# EAGLE design schematic (EAGLE 7.1.0)
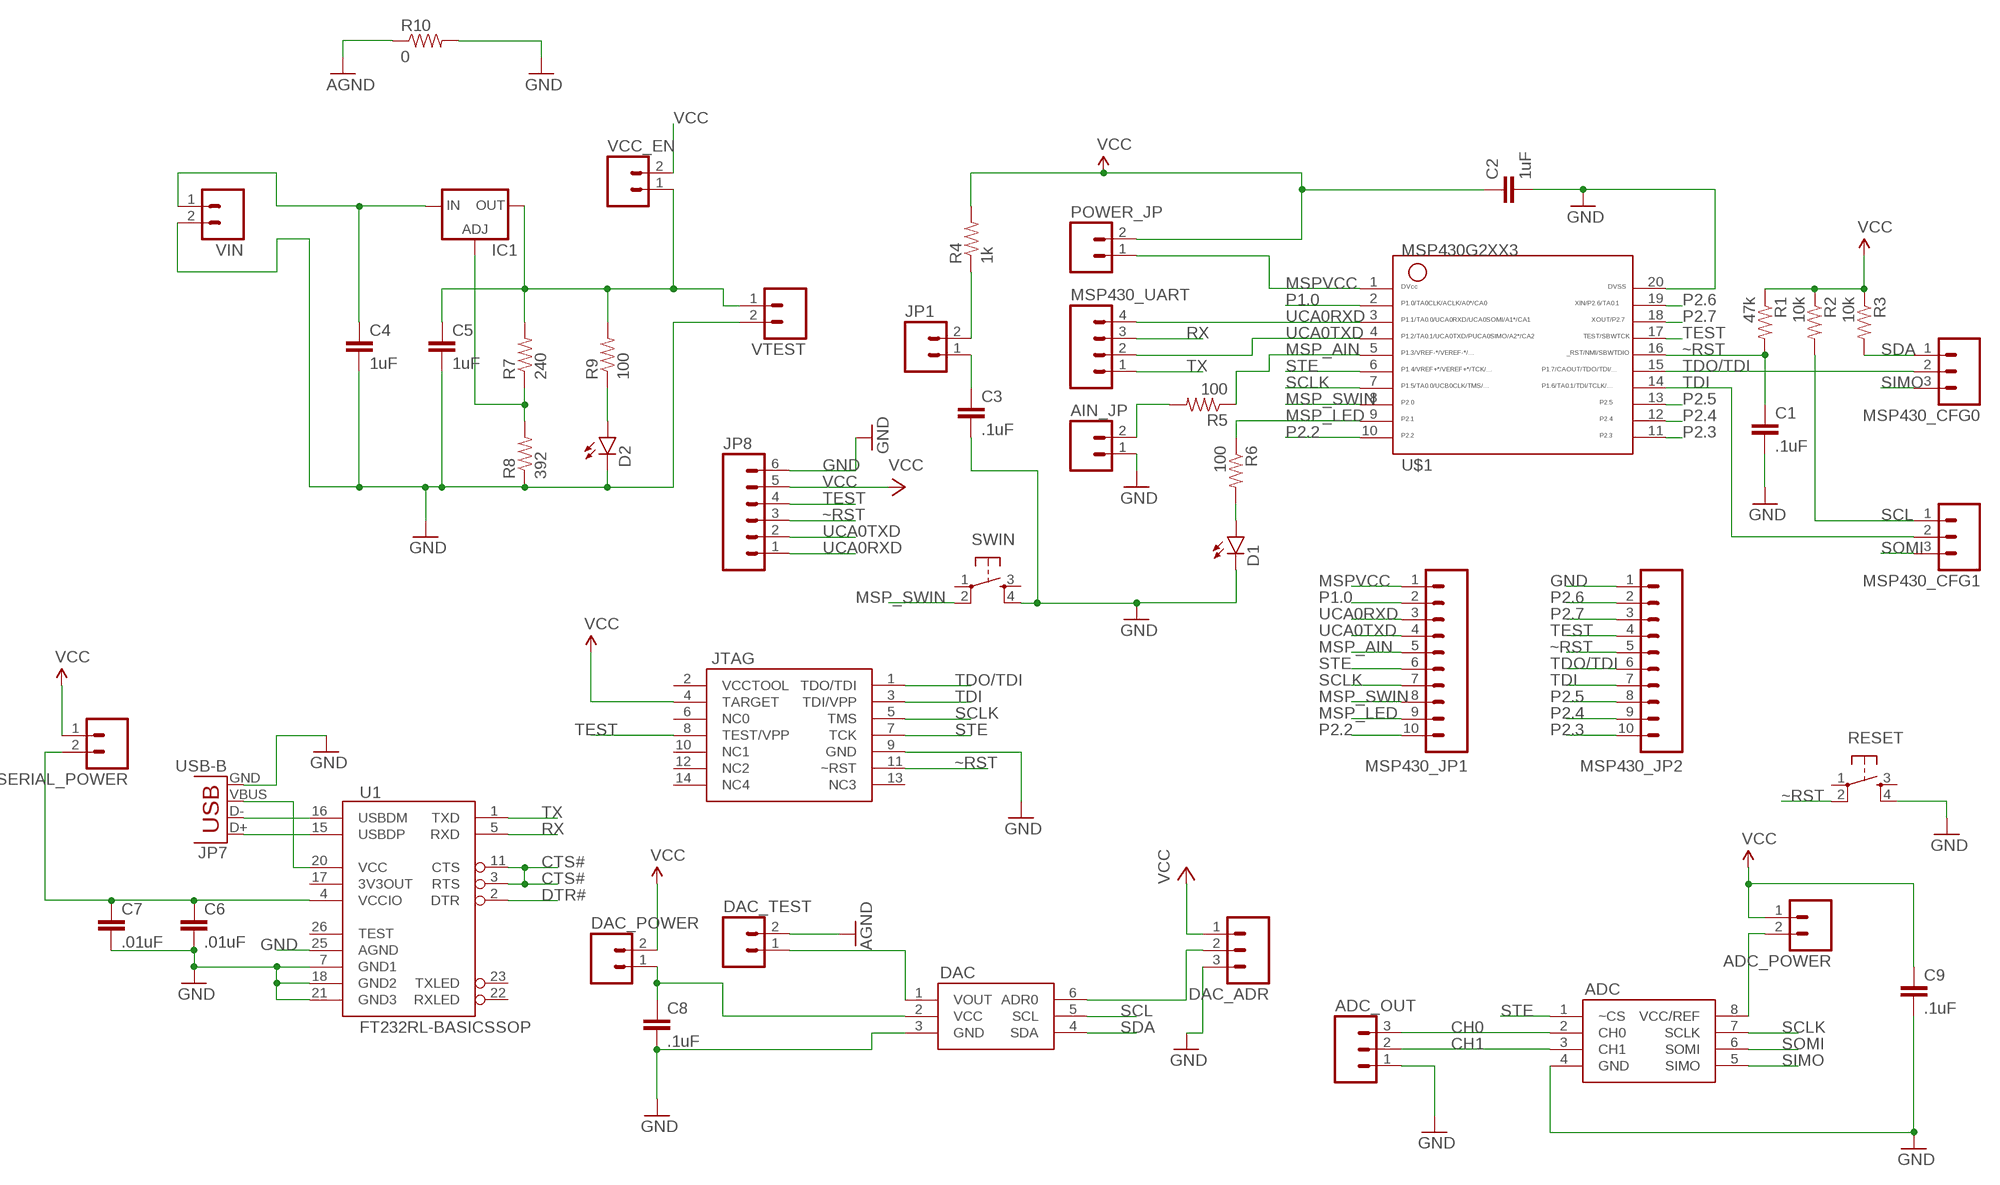
[diagram p0: schematic, sheet 1]

## Parts
ADC  TLC0832CPE4  [DIP08]
ADC_OUT  M03LOCK  [1X03_LOCK]
ADC_POWER  M02LOCK  [1X02_LOCK]
AIN_JP  M02LOCK  [1X02_LOCK]
C1  .1uF  0.1UF-50V-20%(PTH)KIT-EZ  [CAP-PTH-SMALL-KIT]
C2  1uF  CAPKIT  [CAP-PTH-SMALL-KIT]
C3  .1uF  CAPEZ  [CAP-PTH-SMALLEZ]
C4  1uF  CAPEZ  [CAP-PTH-SMALLEZ]
C5  1uF  CAPEZ  [CAP-PTH-SMALLEZ]
C6  .01uF  CAPEZ  [CAP-PTH-SMALLEZ]
C7  .01uF  CAPEZ  [CAP-PTH-SMALLEZ]
C8  .1uF  CAPEZ  [CAP-PTH-SMALLEZ]
C9  .1uF  CAPEZ  [CAP-PTH-SMALLEZ]
D1  LED5MM  [LED5MM]
D2  LED5MM  [LED5MM]
DAC  DAC121C081CIMK  [SOT23-6]
DAC_ADR  M03LOCK  [1X03_LOCK]
DAC_POWER  M02LOCK  [1X02_LOCK]
DAC_TEST  M02LOCK  [1X02_LOCK]
IC1  LM317TS  [317TS]
JP1  M02LOCK  [1X02_LOCK]
JP7  USB-B  USBPTH  [USB-B-PTH]
JP8  M06LOCK  [1X06_LOCK]
JTAG  JTAG  [2X7]
MSP430_CFG0  M03LOCK_NO_SILK  [1X03_LOCK_NO_SILK]
MSP430_CFG1  M03LOCK_NO_SILK  [1X03_LOCK_NO_SILK]
MSP430_JP1  M10LOCK  [1X10_LOCK]
MSP430_JP2  M10LOCK  [1X10_LOCK]
MSP430_UART  M04LOCK_LONGPADS  [1X04_LOCK_LONGPADS]
POWER_JP  M02LOCK  [1X02_LOCK]
R1  47k  RESISTOREZ  [AXIAL-0.3EZ]
R2  10k  RESISTOREZ  [AXIAL-0.3EZ]
R3  10k  RESISTOREZ  [AXIAL-0.3EZ]
R4  1k  RESISTOREZ  [AXIAL-0.3EZ]
R5  100  RESISTOREZ  [AXIAL-0.3EZ]
R6  100  RESISTOREZ  [AXIAL-0.3EZ]
R7  240  RESISTOREZ  [AXIAL-0.3EZ]
R8  392  RESISTOREZ  [AXIAL-0.3EZ]
R9  100  RESISTOREZ  [AXIAL-0.3EZ]
R10  0  RESISTOREZ  [AXIAL-0.3EZ]
RESET  TAC_SWITCHPTH  [TACTILE-PTH]
SERIAL_POWER  M02LOCK  [1X02_LOCK]
SWIN  TAC_SWITCHPTH  [TACTILE-PTH]
U1  FT232RL-BASICSSOP  [SSOP28DB]
U$1  G2XX3---N20  [N20]
VCC_EN  M02LOCK  [1X02_LOCK]
VIN  M02LOCK  [1X02_LOCK]
VTEST  M02LOCK  [1X02_LOCK]

## Nets
CH0: ADC.2(CH0) ADC_OUT.3
CH1: ADC.3(CH1) ADC_OUT.2
CTS#: U1.3(RTS) U1.11(CTS)
DTR#: U1.2(DTR)
GND: ADC.4(GND) ADC_OUT.1 AIN_JP.1 C1.2 C2.2 C3.2 C4.2 C5.2 C6.2 C7.2 C8.2 C9.2 D1.K(C) D2.K(C) DAC.3(GND) DAC_ADR.3 DAC_TEST.2 JP7.GND JP8.6 JTAG.9(GND) MSP430_JP2.1 R8.P$1 R10.P$1 R10.P$2 RESET.4 SWIN.4 U1.7(GND1) U1.18(GND2) U1.21(GND3) U1.25(AGND) U$1.20 VIN.2 VTEST.2 ; supply symbol labelled AGND
MSP_AIN: MSP430_JP1.5 R5.P$1 U$1.5
MSP_LED: MSP430_JP1.9 R6.P$1 U$1.9
MSP_SWIN: MSP430_JP1.8 SWIN.2 U$1.8
MSPVCC: MSP430_JP1.1 POWER_JP.1 U$1.1
N$1: AIN_JP.2 R5.P$2
N$2: D1.A R6.P$2
N$3: JP1.2 R4.P$1
N$4: C3.1 JP1.1
N$5: C6.1 C7.1 SERIAL_POWER.2 U1.4(VCCIO)
N$6: D2.A R9.P$1
N$7: JP7.D+ U1.15(USBDP)
N$8: IC1.1(ADJ) R7.P$1 R8.P$2
N$9: C5.1 IC1.2(OUT) R7.P$2 R9.P$2 VCC_EN.1 VTEST.1
N$10: JP7.D- U1.16(USBDM)
N$11: C4.1 IC1.3(IN) VIN.1
N$12: JP7.VBUS U1.20(VCC)
N$13: DAC.1(VOUT) DAC_TEST.1
N$14: C8.1 DAC.2(VCC) DAC_POWER.1
N$15: ADC.8(VCC/REF) ADC_POWER.2
N$19: DAC.6(ADR0) DAC_ADR.2
P1.0: MSP430_JP1.2 U$1.2
P2.2: MSP430_JP1.10 U$1.10
P2.3: MSP430_JP2.10 U$1.11
P2.4: MSP430_JP2.9 U$1.12
P2.5: MSP430_JP2.8 U$1.13
P2.6: MSP430_JP2.2 U$1.19
P2.7: MSP430_JP2.3 U$1.18
RX: MSP430_UART.3 U1.5(RXD)
SCL: DAC.5(SCL) MSP430_CFG1.1 R2.P$2
SCLK: ADC.7(SCLK) JTAG.5(TMS) MSP430_JP1.7 U$1.7
SDA: DAC.4(SDA) MSP430_CFG0.1 R3.P$2
SIMO: ADC.5(SIMO) MSP430_CFG0.3
SOMI: ADC.6(SOMI) MSP430_CFG1.3
STE: ADC.1(~CS) JTAG.7(TCK) MSP430_JP1.6 U$1.6
TDI: JTAG.3(TDI/VPP) MSP430_CFG1.2 MSP430_JP2.7 U$1.14
TDO/TDI: JTAG.1(TDO/TDI) MSP430_CFG0.2 MSP430_JP2.6 U$1.15
TEST: JP8.4 JTAG.8(TEST/VPP) MSP430_JP2.4 U$1.17
TX: MSP430_UART.1 U1.1(TXD)
UCA0RXD: JP8.1 MSP430_JP1.3 MSP430_UART.4 U$1.3
UCA0TXD: JP8.2 MSP430_JP1.4 MSP430_UART.2 U$1.4
VCC: ADC_POWER.1 C2.1 C9.1 DAC_ADR.1 DAC_POWER.2 JP8.5 JTAG.4(TARGET) POWER_JP.2 R1.P$1 R2.P$1 R3.P$1 R4.P$2 SERIAL_POWER.1 VCC_EN.2
~RST: C1.1 JP8.3 JTAG.11(~RST) MSP430_JP2.5 R1.P$2 RESET.2 U$1.16
Unconnected: JTAG.2(VCCTOOL) JTAG.6(NC0) JTAG.10(NC1) JTAG.12(NC2) JTAG.13(NC3) JTAG.14(NC4) RESET.1 RESET.3 SWIN.1 SWIN.3 U1.17(3V3OUT) U1.22(RXLED) U1.23(TXLED) U1.26(TEST)

## Library data of the parts
ADC = senior-design:TLC0832CPE4
ADC_OUT DAC_ADR MSP430_CFG0 MSP430_CFG1 = SparkFun-Connectors:M03: Header 3 Standard 3-pin 0.1" header. Use with straight break away headers (SKU : PRT-00116), right angle break away headers (PRT-00553), swiss pins (PRT-00743), machine pins (PRT-00117), and female headers (PRT-00115). Molex polarized connector foot print use with SKU : PRT-08232 with associated crimp pins and housings.
ADC_POWER AIN_JP DAC_POWER DAC_TEST JP1 POWER_JP SERIAL_POWER VCC_EN VIN VTEST = SparkFun-Connectors:M02: Standard 2-pin 0.1" header. Use with - straight break away headers ( PRT-00116) - right angle break away headers (PRT-00553) - swiss pins (PRT-00743) - machine pins (PRT-00117) - female headers (PRT-00115) Molex polarized connector foot print use with: PRT-08233 with associated crimp pins and housings. 2.54_SCREWTERM for use with PRT-10571. 3.5mm Screw Terminal footprints for PRT-08084 5mm Screw Terminal footprints for use with PRT-08432
C1 = SparkFun-Capacitors:0.1UF-50V-20%(PTH): CAP-08370; PROD_ID: CAP-08370
C2-C9 = SparkFun-Capacitors:CAP: Capacitor Standard 0603 ceramic capacitor, and 0.1" leaded capacitor.
D1 D2 = SparkFun-LED:LED: LEDs Standard schematic elements and footprints for 5mm, 3mm, 1206, and 0603 sized LEDs. 5mm - Spark Fun Electronics SKU : COM-00529 (and others)
DAC = senior-design:DAC121C081CIMK
IC1 = v-reg:LM317TS: VOLTAGE REGULATOR
JP7 = SparkFun-Connectors:USB: USB Connectors USB-B-PTH is fully proven SKU : PRT-00139/CONN-08278 USB-miniB is fully proven SKU : PRT-00587 USB-A-PCB is untested. USB-A-H is throughly reviewed, but untested. Spark Fun Electronics SKU : PRT-00437 USB-B-SMT is throughly reviewed, but untested. Needs silkscreen touching up. USB-A-S has not been used/tested USB-MB-H has not been used/tested USB-MICROB has been used. CONN-09505; PROD_ID: CONN-08278
JP8 = SparkFun-Connectors:M06: Header 6 Standard 6-pin 0.1" header. Use with straight break away headers (SKU : PRT-00116), right angle break away headers (PRT-00553), swiss pins (PRT-00743), machine pins (PRT-00117), and female headers (PRT-00115). Molex polarized connector foot print use with SKU : PRT-08094 with associated crimp pins and housings. NOTES ON THE VARIANTS LOCK and LOCK_LONGPADS... This footprint was designed to help hold the alignment of a through-hole component (i.e. 6-pin header) while soldering it into place. You may notice that each hole has been shifted either up or down by 0.005 of an inch from it's more standard position (which is a perfectly straight line). This slight alteration caused the pins (the squares in the middle) to touch the edges of the holes. Because they are alternating, it causes a "brace" to hold the component in place. 0.005 has proven to be the perfect amount of "off-center" position when using our standard breakaway headers. Although looks a little odd when you look at the bare footprint, once you have a header in there, the alteration is very hard to notice. Also,if you push a header all the way into place, it is covered up entirely on the bottom side. This idea of altering the position of holes to aid alignment will be further integrated into the Sparkfun Library for other footprints. It can help hold any component with 3 or more connection pins.
JTAG = senior-design:JTAG
MSP430_JP1 MSP430_JP2 = SparkFun-Connectors:M10: Header 10 Standard 10-pin 0.1" header. Use with straight break away headers (SKU : PRT-00116), right angle break away headers (PRT-00553), swiss pins (PRT-00743), machine pins (PRT-00117), and female headers (PRT-00115).
MSP430_UART = SparkFun-Connectors:M04: Header 4 Standard 4-pin 0.1" header. Use with straight break away headers (SKU : PRT-00116), right angle break away headers (PRT-00553), swiss pins (PRT-00743), machine pins (PRT-00117), and female headers (PRT-00115). Molex polarized connector foot print use with SKU : PRT-08231 with associated crimp pins and housings. 1MM SMD Version SKU: PRT-10208
R1-R10 = SparkFun-Passives:RESISTOR: Resistor Basic schematic elements and footprints for 0603, 1206, and PTH resistors.
RESET SWIN = SparkFun-Retired:TAC_SWITCH: Momentary Switch Button commonly used for reset or general input. Spark Fun Electronics SKU : COM-00097 SMT- SWCH-08247
U1 = SparkFun-DigitalIC:FT232RL-BASIC: USB UART This is the simplified version of the FT232RL unit. Only what you need, nothing you don't. Spark Fun Electronics SKU : COM-00650
U$1 = TI_MSP430_v16:G2XX3---N20: MSP430G2XX1 PDIP (N) 20 Pin Package

## Board
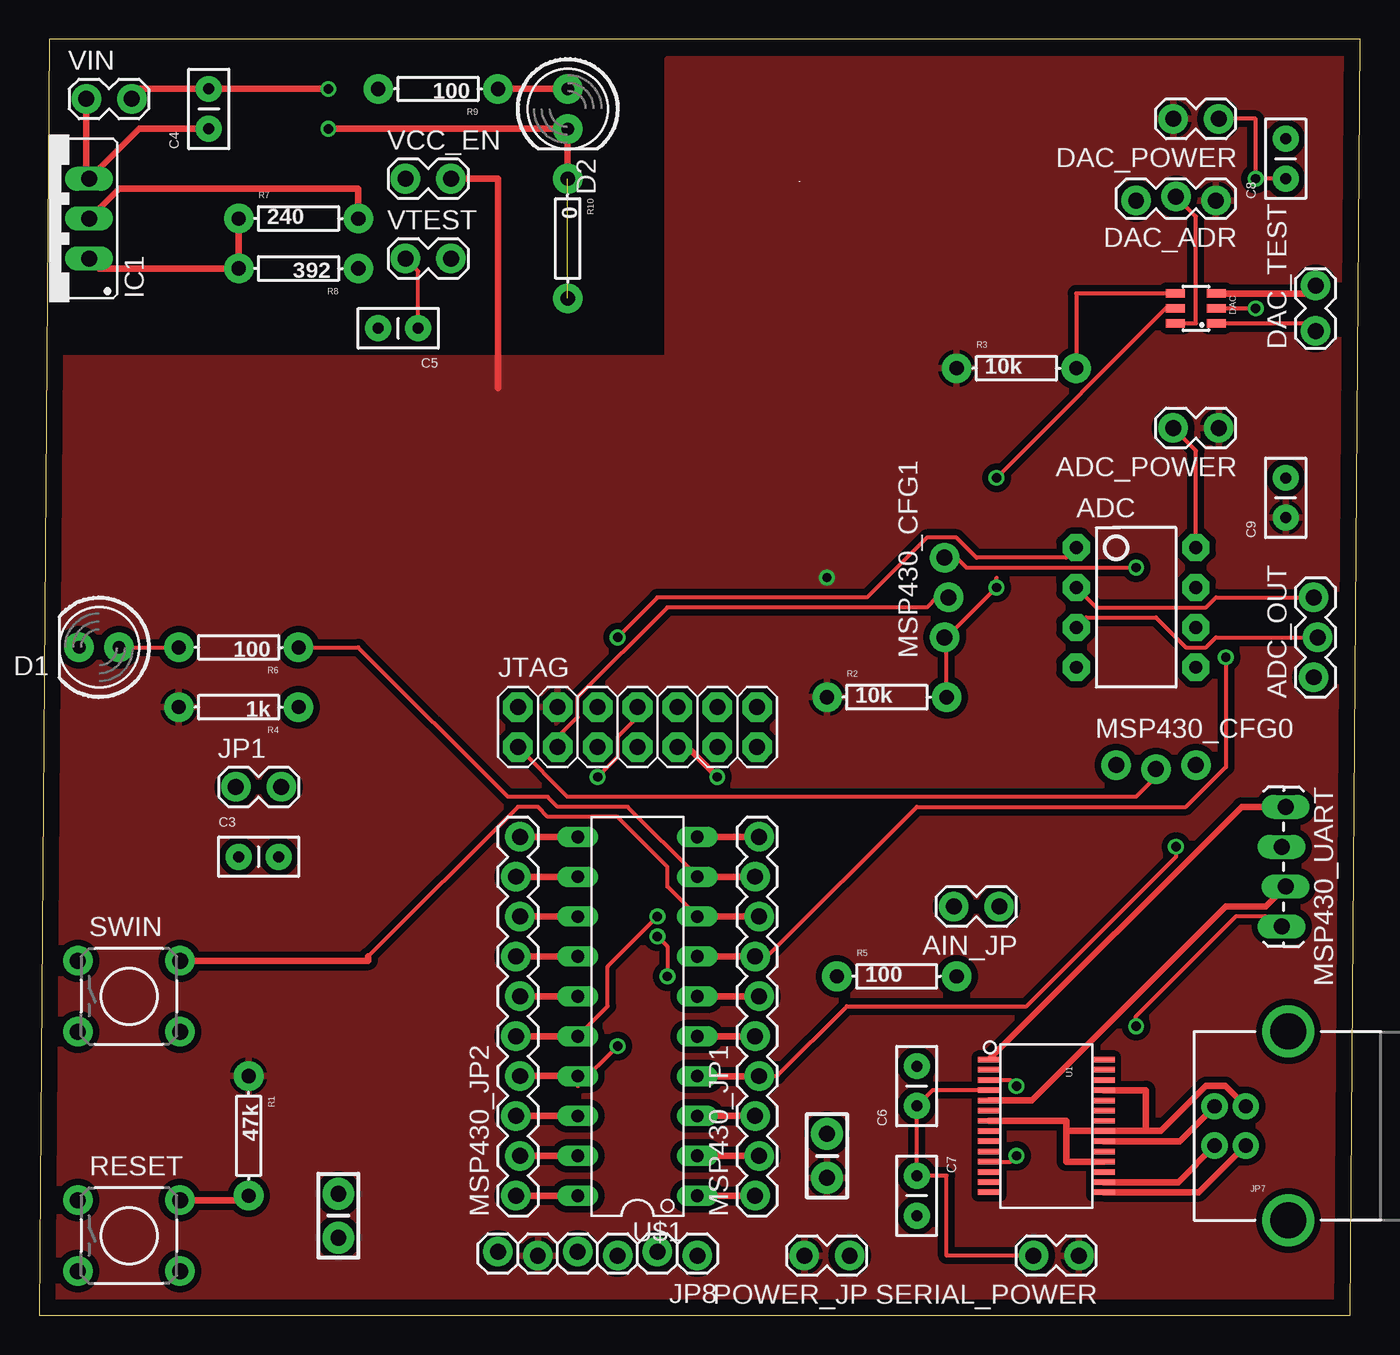
[diagram p1: board, top side]
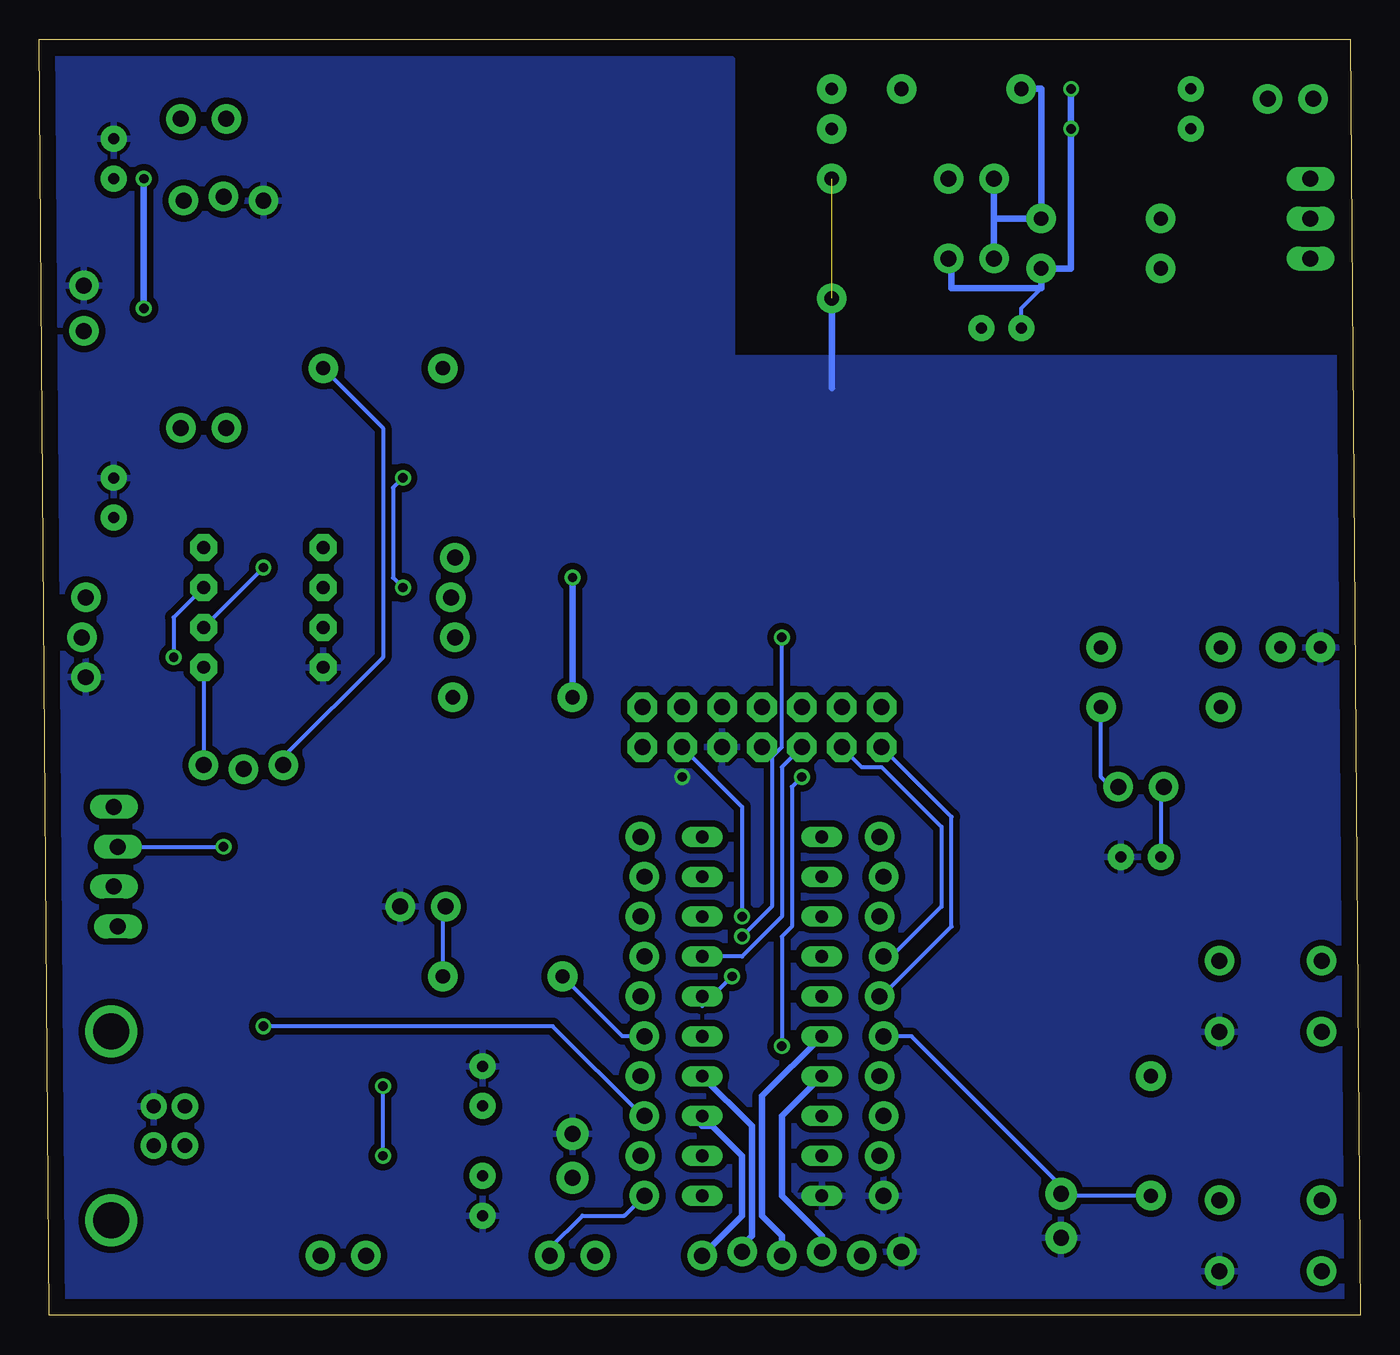
[diagram p2: board, bottom side, seen from below]

Size 84.12 x 81.27 mm. Coordinates in mm from the lower left corner, seen from the top.
Outline: 0,0 83.49,0 84.12,81.27 0.64,81.27 0,0
Copper layers (1*16): Top 0.035mm / dielectric 1.5mm / Bottom 0.035mm
Design rules "default *": minimum track width 10mil, minimum drill 15mil, track to track 8mil, track to pad 8mil, pad to pad 8mil, via to via 8mil, smd to smd 8mil, copper to edge 40mil, drill to drill 8mil, minimum pad ring 10mil, minimum via ring 8mil, stop-mask expansion 4mil, vias tented up to drill 0mil, thermal gap 10mil

### Footprints (pad centres in the part's own frame; a part is rotated, then mirrored left to right if it is on the bottom)
DIP08 = drill 0.813 pad 1.727 octagon: 1 -3.81,-3.81; 2 -1.27,-3.81; 3 1.27,-3.81; 4 3.81,-3.81; 5 3.81,3.81; 6 1.27,3.81; 7 -1.27,3.81; 8 -3.81,3.81
1X03_LOCK = drill 1.016 pad 1.88: 1 0,0.127; 2 2.54,-0.127; 3 5.08,0.127
1X02_LOCK = drill 1.016 pad 1.88: 1 -0.178,0; 2 2.718,0
CAP-PTH-SMALL-KIT = drill 1.016 pad 2.032: 1 -1.397,0; 2 1.397,0
CAP-PTH-SMALLEZ = drill 0.7 pad 1.651: 1 0,0; 2 2.54,0
LED5MM = drill 0.813 pad 1.88: A -1.27,0; K 1.27,0
SOT23-6 = smd 0.55 x 1.2: 1 0.95,1.3; 2 0,1.3; 3 -0.95,1.3; 4 -0.95,-1.3; 5 0,-1.3; 6 0.95,-1.3
317TS = drill 1.016 long: 1 -2.54,-2.54; 2 0,-2.54; 3 2.54,-2.54
USB-B-PTH = drill 0.914 pad 1.676: D+ 0,1.25; D- 1.981,1.25; GND 0,-1.25; VBUS 1.981,-1.25 | drill 2.286: S1 -2.718,-6.02; S2 -2.718,6.02
1X06_LOCK = drill 1.016 pad 1.88: 1 0,0; 2 2.54,-0.254; 3 5.08,0; 4 7.62,-0.254; 5 10.16,0; 6 12.7,-0.254
2X7 = drill 1.016 pad 1.88 octagon: 1 0,0; 2 0,2.54; 3 2.54,0; 4 2.54,2.54; 5 5.08,0; 6 5.08,2.54; 7 7.62,0; 8 7.62,2.54; 9 10.16,0; 10 10.16,2.54; 11 12.7,0; 12 12.7,2.54; 13 15.24,0; 14 15.24,2.54
1X03_LOCK_NO_SILK = drill 1.016 pad 1.88: 1 0,0.127; 2 2.54,-0.127; 3 5.08,0.127
1X10_LOCK = drill 1.016 pad 1.88: 1 0,0.127; 2 2.54,-0.127; 3 5.08,0.127; 4 7.62,-0.127; 5 10.16,0.127; 6 12.7,-0.127; 7 15.24,0.127; 8 17.78,-0.127; 9 20.32,0.127; 10 22.86,-0.127
1X04_LOCK_LONGPADS = drill 1.016 long: 1 0,0; 2 2.54,-0.254; 3 5.08,0; 4 7.62,-0.254
AXIAL-0.3EZ = drill 0.9 pad 1.88: P$1 -3.81,0; P$2 3.81,0
TACTILE-PTH = drill 1.016 pad 1.88: 1 -3.251,2.261; 2 3.251,2.261; 3 -3.251,-2.261; 4 3.251,-2.261
SSOP28DB = smd 0.348 x 1.397: 1 -4.225,-3.656; 2 -3.575,-3.656; 3 -2.925,-3.656; 4 -2.275,-3.656; 5 -1.625,-3.656; 6 -0.975,-3.656; 7 -0.325,-3.656; 8 0.325,-3.656; 9 0.975,-3.656; 10 1.625,-3.656; 11 2.275,-3.656; 12 2.925,-3.656; 13 3.575,-3.656; 14 4.225,-3.656; 15 4.225,3.656; 16 3.575,3.656; 17 2.925,3.656; 18 2.275,3.656; 19 1.625,3.656; 20 0.975,3.656; 21 0.325,3.656; 22 -0.325,3.656; 23 -0.975,3.656; 24 -1.625,3.656; 25 -2.275,3.656; 26 -2.925,3.656; 27 -3.575,3.656; 28 -4.225,3.656
N20 = drill 0.813 long: 1 -11.435,-3.81; 2 -8.895,-3.81; 3 -6.355,-3.81; 4 -3.815,-3.81; 5 -1.275,-3.81; 6 1.265,-3.81; 7 3.805,-3.81; 8 6.345,-3.81; 9 8.885,-3.81; 10 11.425,-3.81; 11 11.425,3.81; 12 8.885,3.81; 13 6.345,3.81; 14 3.805,3.81; 15 1.265,3.81; 16 -1.275,3.81; 17 -3.815,3.81; 18 -6.355,3.81; 19 -8.895,3.81; 20 -11.435,3.81

### Placement (x,y rotation side)
ADC  69.85,45.09 270 top
ADC_OUT  81.28,40.64 90 top
ADC_POWER  74.93,56.52 180 top
AIN_JP  60.96,26.04 180 top
C1  19.05,6.35 270 top
C2  50.16,10.16 90 top
C3  12.7,29.21 0 top
C4  10.79,75.56 90 top
C5  24.13,62.87 180 top
C6  55.88,13.34 90 top
C7  55.88,8.89 270 top
C8  79.38,72.39 90 top
C9  79.38,50.8 90 top
D1  3.81,42.55 180 top
D2  33.66,76.83 270 top
DAC  73.66,64.14 270 top
DAC_ADR  74.93,71.12 180 top
DAC_POWER  74.93,76.2 180 top
DAC_TEST  81.28,62.87 90 top
IC1  0.64,69.85 90 top
JP1  12.7,33.66 0 top
JP7  76.83,12.06 180 top
JP8  41.91,3.81 180 top
JTAG  30.48,36.2 0 top
MSP430_CFG0  68.58,34.92 0 top
MSP430_CFG1  57.78,43.18 90 top
MSP430_JP1  45.72,7.62 90 top
MSP430_JP2  30.48,7.62 90 top
MSP430_UART  79.38,32.38 270 top
POWER_JP  51.44,3.81 180 top
R1  13.34,11.43 270 top
R2  53.98,39.37 0 top
R3  62.23,60.33 0 top
R4  12.7,38.73 180 top
R5  54.61,21.59 0 top
R6  12.7,42.55 180 top
R7  16.51,69.85 0 top
R8  16.51,66.67 180 top
R9  25.4,78.11 180 top
R10  33.66,68.58 270 top
RESET  5.71,5.08 0 top
SERIAL_POWER  66.04,3.81 180 top
SWIN  5.71,20.32 0 top
U1  64.14,12.06 270 top
U$1  38.1,19.05 90 top
VCC_EN  23.5,72.39 0 top
VIN  3.17,77.47 0 top
VTEST  23.5,67.31 0 top

### Tracks (layer width: path | path; a pad name or v marks a point on that pad's centre or on a via)
CH0
  Top 0.254: ADC_OUT.3 74.93,45.72 74.3,45.09 67.31,45.09 ADC.2
CH1
  Top 0.254: ADC_OUT.2 74.93,43.18 74.3,42.55 73.03,42.55 71.12,44.45 66.67,44.45 ADC.3
CTS#  (via drill 0.6)
  Top 0.254: U1.3 61.84,14.99 v62.23,14.61 | U1.11 61.86,9.79 v62.23,10.16
  Bottom 0.254: v62.23,10.16 v62.23,14.61
GND  (via drill 0.6)  (1 unrouted)
  Top 0.406: U$1.20 MSP430_JP2.1 | U1.7 65.41,12.39 65.41,11.74 | 65.41,11.74 U1.21 70.48,11.74 | U1.18 65.41,9.79 65.41,11.74 | 70.48,11.74 71.43,11.74 74.3,14.61 75.55,14.61 JP7.GND | v18.41,78.11 C4.2 5.89,78.11 VIN.2 | v18.41,75.56 D2.K R10.P$1 | U1.25 70.48,14.34 70.48,11.74 | DAC.3 81.28,65.08 DAC_TEST.2 | v43.18,34.29 41.27,36.2 JTAG.9
  Bottom 0.254: C5.2 21.59,64.14 20.32,65.41
  Bottom 0.406: v18.41,78.11 v18.41,75.56 18.41,66.67 R8.P$1 20.32,65.41 26.04,65.41 26.04,67.31 VTEST.2 | R10.P$2 33.66,59.05
  pour Bottom (isolate 0.406): 0,60.96 0,0 83.82,0 83.82,80.01 40.01,80.01 40.01,60.96
MSP_AIN
  Top 0.406: U$1.5 MSP430_JP1.5
  Bottom 0.254: MSP430_JP1.5 46.99,17.78 R5.P$1
MSP_LED
  Top 0.254: U$1.9 37.47,32.38 33.02,32.38 32.38,33.02 29.84,33.02 20.32,42.55 R6.P$1
  Top 0.406: U$1.9 MSP430_JP1.9
MSP_SWIN
  Top 0.254: U$1.8 40.01,27.3 40.01,28.57 36.83,31.75 32.38,31.75 31.75,32.38 30.48,32.38 20.95,22.86
  Top 0.406: U$1.8 MSP430_JP1.8 | SWIN.2 20.95,22.58 20.95,22.86
MSPVCC
  Top 0.406: U$1.1 MSP430_JP1.1
  Bottom 0.254: POWER_JP.1 51.61,4.27 49.53,6.35 46.86,6.35 MSP430_JP1.1
N$1
  Bottom 0.254: R5.P$2 58.42,25.86 AIN_JP.2
N$2
  Top 0.254: D1.A R6.P$2
N$3
  Bottom 0.254: R4.P$1 16.51,34.29 15.88,33.66 JP1.2
N$4
  Bottom 0.254: C3.1 12.7,33.66 JP1.1
N$5
  Top 0.254: SERIAL_POWER.2 57.78,3.81 57.78,8.89 C7.1 C6.1 56.88,14.34 U1.4
N$6
  Top 0.254: 33.02,78.11 D2.A
  Top 0.406: R9.P$1 33.02,78.11
N$7
  Top 0.406: U1.15 73.86,7.84 JP7.D+
N$8
  Top 0.406: IC1.1 3.81,66.67 R8.P$2 R7.P$1
N$9
  Top 0.254: C5.1 24.13,66.5 VTEST.1
  Top 0.406: IC1.2 5.08,71.75 20.32,71.75 R7.P$2
  Bottom 0.406: R9.P$2 20.32,78.11 R7.P$2 23.32,69.85 | 23.32,69.85 VCC_EN.1 | VTEST.1 23.32,69.85
N$10
  Top 0.406: U1.16 72.53,8.49 JP7.D-
N$11
  Top 0.406: C4.1 6.35,75.56 IC1.3 3,72.39 VIN.1
N$12
  Top 0.406: U1.20 72.63,11.09 JP7.VBUS
N$13
  Top 0.254: DAC.1 81.28,63.19 DAC_TEST.1
N$14  (via drill 0.6)
  Top 0.254: DAC.2 v77.47,64.14 | DAC_POWER.1 77.47,76.2 v77.47,72.39 C8.1
  Bottom 0.406: v77.47,72.39 v77.47,64.14
N$15
  Top 0.254: ADC.8 73.66,55.07 ADC_POWER.2
N$19
  Top 0.254: DAC.6 73.66,63.19 73.66,69.98 DAC_ADR.2
P1.0
  Top 0.406: U$1.2 MSP430_JP1.2
P2.2
  Top 0.406: U$1.10 MSP430_JP1.10
P2.3
  Top 0.406: U$1.11 MSP430_JP2.10
P2.4
  Top 0.406: U$1.12 MSP430_JP2.9
P2.5
  Top 0.406: U$1.13 MSP430_JP2.8
P2.6
  Top 0.406: U$1.19 MSP430_JP2.2
P2.7
  Top 0.406: U$1.18 MSP430_JP2.3
RX
  Top 0.406: U1.5 63.22,13.69 75.56,26.04 78.11,26.04 MSP430_UART.3
SCL  (via drill 0.6)
  Top 0.254: R2.P$2 57.78,43.18 | 57.78,43.18 v60.96,46.35 60.96,46.99 | 57.78,43.18 MSP430_CFG1.1 | v60.96,53.34 71.75,64.14 DAC.5 72.39,64.14
  Bottom 0.254: v60.96,46.35 61.59,46.99 61.59,52.7 v60.96,53.34
SCLK  (via drill 0.6)
  Top 0.254: MSP430_JP1.7 46.35,22.86 55.88,32.38 73.03,32.38 75.56,34.92 v75.56,41.91
  Top 0.406: U$1.7 MSP430_JP1.7
  Bottom 0.254: JTAG.5 36.83,34.92 36.83,25.4 39.37,22.86 U$1.7 | v75.56,41.91 75.56,44.45 ADC.7
SDA
  Top 0.254: DAC.4 66.04,65.08 R3.P$2
  Bottom 0.254: MSP430_CFG0.1 68.58,35.56 62.23,41.91 62.23,56.52 R3.P$2
SIMO
  Bottom 0.254: ADC.5 MSP430_CFG0.3
SOMI  (via drill 0.6)
  Top 0.254: v69.85,47.62 59.05,47.62 58.42,48.26 MSP430_CFG1.3
  Bottom 0.254: ADC.6 v69.85,47.62
STE  (via drill 0.6)
  Top 0.254: v40.01,21.59 40.01,23.5 v39.37,24.13 | ADC.1 65.41,48.26 59.69,48.26 58.42,49.53 56.52,49.53 52.7,45.72 39.37,45.72 v36.83,43.18
  Top 0.406: U$1.6 MSP430_JP1.6
  Bottom 0.254: v39.37,24.13 37.47,26.04 37.47,35.56 | v40.01,21.59 41.91,19.68 U$1.6 | v36.83,43.18 36.83,36.2 37.47,35.56 | 37.47,35.56 JTAG.7
TDI
  Top 0.254: MSP430_CFG1.2 57.15,45.72 56.52,45.09 40.01,45.09 34.29,39.37 34.29,38.1 33.02,36.83 JTAG.3
  Top 0.406: U$1.14 MSP430_JP2.7
  Bottom 0.254: JTAG.3 31.75,34.92 30.48,34.92 26.67,31.11 26.67,26.04 29.84,22.86 MSP430_JP2.7
TDO/TDI
  Top 0.254: MSP430_CFG0.2 71.12,34.29 69.85,33.02 33.66,33.02 JTAG.1
  Top 0.406: MSP430_JP2.6 U$1.15
  Bottom 0.254: MSP430_JP2.6 30.48,20.32 26.04,24.77 26.04,31.75 JTAG.1
TEST  (via drill 0.6)
  Top 0.254: JTAG.8 38.1,38.1 36.83,36.83 36.83,35.56 v35.56,34.29 | v36.83,17.14 34.29,14.61 U$1.17
  Top 0.406: 30.48,15.24 MSP430_JP2.4 U$1.17
  Bottom 0.254: v36.83,17.14 36.83,24.13 36.2,24.77 36.2,33.66 v35.56,34.29
  Bottom 0.406: U$1.17 36.83,12.7 36.83,7.62 34.29,5.08 JP8.4 34.29,3.81
TX
  Top 0.406: MSP430_UART.1 76.57,32.38 U1.1
UCA0RXD  (via drill 0.6)
  Top 0.254: MSP430_UART.4 78.74,24.77 78.11,25.4 76.2,25.4 69.85,19.05 v69.85,18.41
  Top 0.406: U$1.3 MSP430_JP1.3
  Bottom 0.254: v69.85,18.41 51.44,18.41 45.72,12.7 MSP430_JP1.3
  Bottom 0.406: JP8.1 39.37,6.35 39.37,10.16 41.27,12.06 41.91,12.06 U$1.3
UCA0TXD  (via drill 0.6)
  Top 0.254: v72.39,29.84 72.39,29.21 62.87,19.68 51.44,19.68 46.99,15.24 MSP430_JP1.4
  Top 0.406: U$1.4 MSP430_JP1.4
  Bottom 0.254: MSP430_UART.2 v72.39,29.84
  Bottom 0.406: JP8.2 39.37,4.45 38.73,5.08 38.73,12.06 U$1.4
VCC  (via drill 0.6)
  Top 0.406: VCC_EN.2 29.21,72.39 29.21,59.05
  Bottom 0.406: v50.16,46.99 R2.P$1
  pour Top (isolate 0.406): 0,60.96 0,0 83.82,0 83.82,80.01 40.01,80.01 40.01,60.96
~RST  (via drill 0.6)
  Top 0.254: v39.37,25.4 36.2,22.23 36.2,19.68 U$1.16
  Top 0.406: U$1.16 33.02,17.77 33.02,17.78 MSP430_JP2.5 | RESET.2 13.34,7.34 R1.P$2
  Bottom 0.254: v39.37,25.4 39.37,32.38 JTAG.11 | R1.P$2 19.05,7.62 C1.1 19.05,8.26 28.57,17.78 MSP430_JP2.5
  Bottom 0.406: U$1.16 38.1,13.97 38.1,6.35 36.83,5.08 JP8.3

### Text on the board
tSilk: VCC | gnd | power
202bmp: /Users/Alex/Desktop/logo.bmp